# Altium project MC3_r2.PrjPcb (part 6 of 10)

## Sheet DigitalInputs.SchDoc
size Letter; Organization: Altium Limited; Address1: L3, 12a Rodborough Rd; Address2: Frenchs Forest; Address3: NSW; Address4: Australia 2086; DocumentNumber: D_15; SheetNumber: 15; SheetTotal: 21
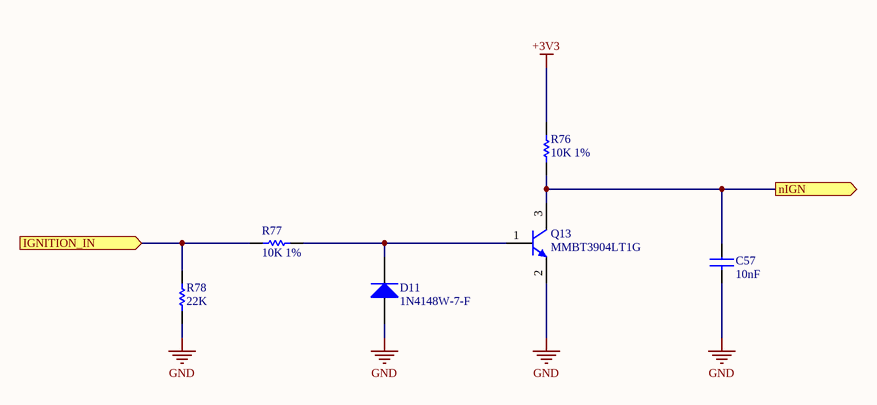
[diagram p9: DigitalInputs.SchDoc]

### Parts
C57  10nF  [C0805]
D11  1N4148W-7-F  [DIOD-SOD123-2_V]
Q13  MMBT3904LT1G  [ONSC-SOT-23-3-318-08_V]
R76  10K 1%  [R0805]
R77  10K 1%  [R0805]
R78  22K  [R0805]

### Ports
IGNITION_IN (in), nIGN (out)

### Nets
+3V3: R76.2
GND: C57.2 D11.1(A) Q13.2(E) R78.1
IGNITION: R77.1 R78.2 ; port IGNITION_IN
nIGNITION: C57.1 Q13.3(C) R76.1 ; port nIGN
NetD11_2: D11.2(K) Q13.1(B) R77.2

### Notes on the sheet
- Title
- Size:
- Date:
- Letter
- Number:
- Time:
- Revision:
- Sheet
- of
- Fluid Power Training
- Institute Inc.
- 2170 S 3040 W
- Salt Lake City, 84119,UT.
- United States.
- File:

### Library data of the parts
C57 = CC0805KRX7R9BB103: YAGEO - CC0805KRX7R9BB103 - SMD Multilayer Ceramic Capacitor, 10000 pF, 50 V, 0805 [2012 Metric], ± 10%, X7R, CC Series; Voltage Rating: 50V; Insulation Resistance: 100GR; Supplier 1: Mouser; Supplier Part Number 1: 603-CC805KRX7R9BB103; Manufacturer: Yageo; Manufacturer Part Number: CC0805KRX7R9BB103; RoHS: Yes; Category: Ceramic Capacitors; Stock 1: 473100; Pricing 1: 1=0.11000, 10=0.05700, 100=0.02600, 1000=0.02100, 4000=0.01600, 8000=0.01400 (USD); Mount: Surface Mount; Case/Package: 0805; Number of Pins: 2; Case Code (Imperial): 0805; Case Code (Metric): 2012; Material: Ceramic; Min Operating Temperature: -55°C; Max Operating Temperature: 125°C; Packaging: Tape and Reel; Capacitance: 10nF; Tolerance: 10%; Package Quantity: 1; Dielectric: X7R; Termination: SMD/SMT; Voltage Rating (DC): 50V; Voltage: 50V; Composition: Ceramic; Length: 2mm; Height: 0.6mm; Width: 1.25mm; Depth: 1.25mm; Thickness: 0.024inch; Radiation Hardening: No; REACH SVHC: No SVHC; Lead Free: Lead Free; Halogen Free: Halogen Free; ComponentLink1URL: https://datasheet.ciiva.com/11786/0900766b80d84f1d-11786119.pdf?src-supplier=RSComponents; ComponentLink1Description: https://datasheet.ciiva.com/11786/0900766b80d84f1d-11786119.pdf?src-supplier=RSComponents; ComponentLink2URL: https://datasheet.ciiva.com/25613/0900766b8027bcf6-25613113.pdf?src-supplier=RSComponents; ComponentLink2Description: https://datasheet.ciiva.com/25613/0900766b8027bcf6-25613113.pdf?src-supplier=RSComponents; ComponentLink3URL: https://datasheet.ciiva.com/144/mlccorderingcode-144533.pdf?src-supplier=Digi-Key; ComponentLink3Description: https://datasheet.ciiva.com/144/mlccorderingcode-144533.pdf?src-supplier=Digi-Key; ComponentLink4URL: https://datasheet.ciiva.com/144/mlccorderingcode-144534.pdf?src-supplier=Digi-Key; ComponentLink4Description: https://datasheet.ciiva.com/144/mlccorderingcode-144534.pdf?src-supplier=Digi-Key; ComponentLink5URL: https://datasheet.ciiva.com/46372/1784427-46372638.pdf?src-supplier=Element14; ComponentLink5Description: https://datasheet.ciiva.com/46372/1784427-46372638.pdf?src-supplier=Element14; ComponentLink6URL: https://datasheet.ciiva.com/144/mlccorderingcode-144532.pdf?src-supplier=Digi-Key; ComponentLink6Description: https://datasheet.ciiva.com/144/mlccorderingcode-144532.pdf?src-supplier=Digi-Key; ComponentLink7URL: https://datasheet.ciiva.com/16625/upy-gphc-x7r-6-3v-to-50v-8-16625548.pdf?src-supplier=Avnet+Europe; ComponentLink7Description: https://datasheet.ciiva.com/16625/upy-gphc-x7r-6-3v-to-50v-8-16625548.pdf?src-supplier=Avnet+Europe; ComponentLink8URL: https://datasheet.ciiva.com/22749/1489800-22749215.pdf?src-supplier=Element14; ComponentLink8Description: https://datasheet.ciiva.com/22749/1489800-22749215.pdf?src-supplier=Element14; ComponentLink9URL: https://datasheet.ciiva.com/46372/1734573-46372639.pdf?src-supplier=Element14; ComponentLink9Description: https://datasheet.ciiva.com/46372/1734573-46372639.pdf?src-supplier=Element14
D11 = 1N4148W-7-F: DIODE GEN PURP 100V 300MA SOD123; Manufacturer: Diodes; Reverse Recovery Time: 4ns; Forward Voltage: 1.25V; Element Configuration: Single; Forward Current: 150mA; Peak Non-Repetitive Surge Current: 2A; Power Dissipation: 400mW; Peak Reverse Current: 1uA; Polarity: Standard; Voltage Rating (DC): 75V; Capacitance: 2pF; Current: 15A; Supplier 1: Mouser; Supplier Part Number 1: 621-1N4148W-F; Manufacturer Part Number: 1N4148W-7-F; RoHS: Yes; Category: Rectifier Diodes; Stock 1: 1274151; Pricing 1: 1=0.16000, 10=0.15000, 100=0.05300, 1000=0.03500, 3000=0.02700, 9000=0.02400 (USD); Mount: Surface Mount; Number of Pins: 2; Weight: 0.000353oz; Contact Plating: Tin,Matte; Min Operating Temperature: -65°C; Max Operating Temperature: 150°C; Packaging: Tape and Reel; Max Repetitive Reverse Voltage (Vrrm): 100V; Package Quantity: 3000; Average Rectified Current: 300mA; Max Reverse Voltage (DC): 100V; Recovery Time: 4ns; Max Forward Surge Current (Ifsm): 2A; Max Surge Current: 2A; Current Rating: 150mA; Output Current: 150mA; Voltage: 100V; Power Rating: 400mW; Length: 2.85mm; Height: 1.25mm; Width: 1.7mm; Radiation Hardening: No; Lead Free: Lead Free; REACH SVHC: No SVHC; ComponentLink1URL: https://datasheet.ciiva.com/4435/ds30086-4435128.pdf?src-supplier=Mouser; ComponentLink1Description: https://datasheet.ciiva.com/4435/ds30086-4435128.pdf?src-supplier=Mouser; ComponentLink2URL: https://datasheet.ciiva.com/8300/ds30086-8300392.pdf?src-supplier=Avnet; ComponentLink2Description: https://datasheet.ciiva.com/8300/ds30086-8300392.pdf?src-supplier=Avnet; ComponentLink3URL: https://datasheet.ciiva.com/911/ds30086-911734.pdf?src-supplier=Digi-Key; ComponentLink3Description: https://datasheet.ciiva.com/911/ds30086-911734.pdf?src-supplier=Digi-Key; ComponentLink4URL: https://datasheet.ciiva.com/911/ds30086-911735.pdf?src-supplier=Digi-Key; ComponentLink4Description: https://datasheet.ciiva.com/911/ds30086-911735.pdf?src-supplier=Digi-Key; ComponentLink5URL: https://datasheet.ciiva.com/22695/1915529-22695239.pdf?src-supplier=Element14; ComponentLink5Description: https://datasheet.ciiva.com/22695/1915529-22695239.pdf?src-supplier=Element14; ComponentLink6URL: https://datasheet.ciiva.com/911/ds30086-911736.pdf?src-supplier=Digi-Key; ComponentLink6Description: https://datasheet.ciiva.com/911/ds30086-911736.pdf?src-supplier=Digi-Key; ComponentLink7URL: https://datasheet.ciiva.com/1179/1915529-1179304.pdf?src-supplier=Element14; ComponentLink7Description: https://datasheet.ciiva.com/1179/1915529-1179304.pdf?src-supplier=Element14; ComponentLink8URL: https://datasheet.ciiva.com/25919/ds30086-25919609.pdf?src-supplier=Avnet+Europe; ComponentLink8Description: https://datasheet.ciiva.com/25919/ds30086-25919609.pdf?src-supplier=Avnet+Europe; ComponentLink9URL: https://datasheet.ciiva.com/15219/getdatasheetpartid-110030-15219548.pdf?src-supplier=Verical; ComponentLink9Description: https://datasheet.ciiva.com/15219/getdatasheetpartid-110030-15219548.pdf?src-supplier=Verical; ComponentLink10URL: https://datasheet.ciiva.com/8303/ds30086-8303197.pdf?src-supplier=Avnet; ComponentLink10Description: https://datasheet.ciiva.com/8303/ds30086-8303197.pdf?src-supplier=Avnet
Q13 = MMBT3904LT1G: ON Semi MMBT3904LT1G NPN Bipolar Transistor, 0.2 A, 40 V, 3-Pin SOT-23; Manufacturer: ON Semiconductor; Collector Emitter Breakdown Voltage: 40V; Max Power Dissipation: 300mW; Max Collector Current: 200mA; Collector Base Voltage (VCBO): 60V; Emitter Base Voltage (VEBO): 6V; Element Configuration: Single; Transition Frequency: 300MHz; Collector Emitter Saturation Voltage: 300mV; hFE Min: 100; Number of Elements: 1; Type: General Purpose; Supplier 1: Mouser; Supplier Part Number 1: 863-MMBT3904LT1G; Manufacturer Part Number: MMBT3904LT1G; RoHS: Yes; Category: BJTs; Stock 1: 753014; Pricing 1: 1=0.12000, 10=0.10900, 100=0.03800, 1000=0.02500, 3000=0.01900, 9000=0.01700 (USD); Case/Package: SOT-23-3; Number of Pins: 3; Contact Plating: Tin,Matte; Min Operating Temperature: -55°C; Max Operating Temperature: 150°C; Packaging: Tape and Reel; Polarity: NPN; Collector Emitter Voltage (VCEO): 40V; Package Quantity: 1; Gain Bandwidth Product: 300MHz; Power Dissipation: 300mW; Max Breakdown Voltage: 40V; Voltage Rating (DC): 40V; Current Rating: 200mA; Frequency: 300MHz; Max Frequency: 300MHz; Length: 2.9mm; Height: 0.94mm; Width: 1.3mm; Radiation Hardening: No; Lead Free: Lead Free; REACH SVHC: No SVHC; ComponentLink1URL: https://datasheet.ciiva.com/16199/mmbt3904lt1-d-16199009.pdf?src-supplier=Future+Electronics; ComponentLink1Description: https://datasheet.ciiva.com/16199/mmbt3904lt1-d-16199009.pdf?src-supplier=Future+Electronics; ComponentLink2URL: https://datasheet.ciiva.com/4723/mmbt3904lt1-d-113169-4723050.pdf?src-supplier=Mouser; ComponentLink2Description: https://datasheet.ciiva.com/4723/mmbt3904lt1-d-113169-4723050.pdf?src-supplier=Mouser; ComponentLink3URL: https://datasheet.ciiva.com/15138/getdatasheetpartid-53263-15138779.pdf?src-supplier=Verical; ComponentLink3Description: https://datasheet.ciiva.com/15138/getdatasheetpartid-53263-15138779.pdf?src-supplier=Verical; ComponentLink4URL: https://datasheet.ciiva.com/976/mmbt3904lt1-d-976362.pdf?src-supplier=Digi-Key; ComponentLink4Description: https://datasheet.ciiva.com/976/mmbt3904lt1-d-976362.pdf?src-supplier=Digi-Key; ComponentLink5URL: https://datasheet.ciiva.com/16478/mmbt3904lt1-d-16478538.pdf?src-supplier=Avnet+Asia; ComponentLink5Description: https://datasheet.ciiva.com/16478/mmbt3904lt1-d-16478538.pdf?src-supplier=Avnet+Asia; ComponentLink6URL: https://datasheet.ciiva.com/976/mmbt3904lt1-d-976363.pdf?src-supplier=Digi-Key; ComponentLink6Description: https://datasheet.ciiva.com/976/mmbt3904lt1-d-976363.pdf?src-supplier=Digi-Key; ComponentLink7URL: https://datasheet.ciiva.com/11199/mmbt3904lt1-d-11199003.pdf?src-supplier=Avnet; ComponentLink7Description: https://datasheet.ciiva.com/11199/mmbt3904lt1-d-11199003.pdf?src-supplier=Avnet; ComponentLink8URL: https://datasheet.ciiva.com/976/mmbt3904lt1-d-976364.pdf?src-supplier=Digi-Key; ComponentLink8Description: https://datasheet.ciiva.com/976/mmbt3904lt1-d-976364.pdf?src-supplier=Digi-Key; ComponentLink9URL: https://datasheet.ciiva.com/14546/70099530-14546188.pdf?src-supplier=Allied+Electronics; ComponentLink9Description: https://datasheet.ciiva.com/14546/70099530-14546188.pdf?src-supplier=Allied+Electronics; ComponentLink10URL: https://datasheet.ciiva.com/7972/1708269-7972381.pdf?src-supplier=Element14; ComponentLink10Description: https://datasheet.ciiva.com/7972/1708269-7972381.pdf?src-supplier=Element14; ComponentLink11URL: https://datasheet.ciiva.com/22664/1708269-22664159.pdf?src-supplier=Element14; ComponentLink11Description: https://datasheet.ciiva.com/22664/1708269-22664159.pdf?src-supplier=Element14
R76 R77 = CRCW080510K0FKEA: VISHAY - CRCW080510K0FKEA - SMD Chip Resistor, 0805 [2012 Metric], 10 kohm, CRCW e3 Series, 150 V, Thick Film, 125 mW; Resistance: 10kR; Temperature Coefficient: 100ppm/°C; Power Rating: 125mW; Voltage Rating: 150V; Supplier 1: Mouser; Supplier Part Number 1: 71-CRCW0805-10K-E3; Manufacturer: Vishay; Manufacturer Part Number: CRCW080510K0FKEA; RoHS: Yes; Category: Chip SMD Resistors; Stock 1: 1138857; Pricing 1: 1=0.10000, 10=0.06200, 100=0.02500, 1000=0.01000, 5000=0.00700, 10000=0.00600 (USD); Case/Package: 0805; Weight: 0.000194oz; Case Code (Imperial): 0805; Case Code (Metric): 2012; Contact Plating: Tin; Min Operating Temperature: -55°C; Max Operating Temperature: 155°C; Tolerance: 1%; Packaging: Tape and Reel; Composition: Thick Film; Termination: SMD/SMT; Voltage Rating (DC): 150V; Package Quantity: 5000; Military Standard: Not; Length: 2mm; Height: 0.45mm; Width: 1.25mm; Depth: 1.25mm; Radiation Hardening: No; Lead Free: Lead Free; REACH SVHC: Unknown; ComponentLink1URL: https://datasheet.ciiva.com/11808/0900766b80d98b26-11808216.pdf?src-supplier=RSComponents; ComponentLink1Description: https://datasheet.ciiva.com/11808/0900766b80d98b26-11808216.pdf?src-supplier=RSComponents; ComponentLink2URL: https://datasheet.ciiva.com/5547/dcrcwe3-109170-5547559.pdf?src-supplier=Mouser; ComponentLink2Description: https://datasheet.ciiva.com/5547/dcrcwe3-109170-5547559.pdf?src-supplier=Mouser; ComponentLink3URL: https://datasheet.ciiva.com/16719/70201119-16719082.pdf?src-supplier=Allied+Electronics; ComponentLink3Description: https://datasheet.ciiva.com/16719/70201119-16719082.pdf?src-supplier=Allied+Electronics; ComponentLink4URL: https://datasheet.ciiva.com/16883/dcrcwe3-16883708.pdf?src-supplier=Avnet+Europe; ComponentLink4Description: https://datasheet.ciiva.com/16883/dcrcwe3-16883708.pdf?src-supplier=Avnet+Europe; ComponentLink5URL: https://datasheet.ciiva.com/8337/dcrcwe3-8337773.pdf?src-supplier=Avnet; ComponentLink5Description: https://datasheet.ciiva.com/8337/dcrcwe3-8337773.pdf?src-supplier=Avnet; ComponentLink6URL: https://datasheet.ciiva.com/46394/1720486-46394381.pdf?src-supplier=Element14; ComponentLink6Description: https://datasheet.ciiva.com/46394/1720486-46394381.pdf?src-supplier=Element14; ComponentLink7URL: https://datasheet.ciiva.com/16199/dcrcwe3-16199086.pdf?src-supplier=Future+Electronics; ComponentLink7Description: https://datasheet.ciiva.com/16199/dcrcwe3-16199086.pdf?src-supplier=Future+Electronics; ComponentLink8URL: https://datasheet.ciiva.com/16514/dcrcwe3-16514907.pdf?src-supplier=Avnet+Asia; ComponentLink8Description: https://datasheet.ciiva.com/16514/dcrcwe3-16514907.pdf?src-supplier=Avnet+Asia; ComponentLink9URL: https://datasheet.ciiva.com/16755/70201119-16755389.pdf?src-supplier=Allied+Electronics; ComponentLink9Description: https://datasheet.ciiva.com/16755/70201119-16755389.pdf?src-supplier=Allied+Electronics; ComponentLink10URL: https://datasheet.ciiva.com/8337/dcrcwe3-8337774.pdf?src-supplier=Avnet; ComponentLink10Description: https://datasheet.ciiva.com/8337/dcrcwe3-8337774.pdf?src-supplier=Avnet
R78 = ERJ6ENF2202V: as R41 on sheet RPM Inputs; Supplier 1: Mouser; Supplier Part Number 1: 667-ERJ-6ENF2202V; Manufacturer: Panasonic; Manufacturer Part Number: ERJ6ENF2202V; RoHS: Yes; Category: Chip SMD Resistors; Stock 1: 57430; Pricing 1: 1=0.10000, 10=0.08300, 100=0.03200, 1000=0.01800, 5000=0.01800, 10000=0.01800 (USD); Mount: Surface Mount; Case/Package: 0805; Number of Pins: 2; Case Code (Imperial): 0805; Case Code (Metric): 2012; Contact Plating: Tin; Min Operating Temperature: -55°C; Max Operating Temperature: 155°C; Packaging: Tape and Reel; Composition: Thick Film; Number of Terminations: 2; Max Power Dissipation: 125mW; Termination: SMD/SMT; Package Quantity: 1; Voltage Rating (DC): 150V; Features: Automotive AEC-Q200; Military Standard: Not; Length: 2mm; Height: 0.6mm; Width: 1.2mm; Depth: 1.25mm; Radiation Hardening: No; Lead Free: Lead Free; REACH SVHC: No SVHC; ComponentLink1URL: https://datasheet.ciiva.com/11821/0900766b80f80784-11821559.pdf?src-supplier=RSComponents; ComponentLink1Description: https://datasheet.ciiva.com/11821/0900766b80f80784-11821559.pdf?src-supplier=RSComponents; ComponentLink2URL: https://datasheet.ciiva.com/24070/aoa0000ce2-24070245.pdf?src-supplier=Mouser; ComponentLink2Description: https://datasheet.ciiva.com/24070/aoa0000ce2-24070245.pdf?src-supplier=Mouser; ComponentLink3URL: https://datasheet.ciiva.com/30139/aoa0000ce2-30139797.pdf?src-supplier=Onlinecomponents.com; ComponentLink3Description: https://datasheet.ciiva.com/30139/aoa0000ce2-30139797.pdf?src-supplier=Onlinecomponents.com; ComponentLink4URL: https://datasheet.ciiva.com/7802/426256-7802439.pdf?src-supplier=Element14; ComponentLink4Description: https://datasheet.ciiva.com/7802/426256-7802439.pdf?src-supplier=Element14; ComponentLink5URL: https://datasheet.ciiva.com/22687/1678782-22687079.pdf?src-supplier=Element14; ComponentLink5Description: https://datasheet.ciiva.com/22687/1678782-22687079.pdf?src-supplier=Element14; ComponentLink6URL: https://datasheet.ciiva.com/16787/70260748-16787961.pdf?src-supplier=Allied+Electronics; ComponentLink6Description: https://datasheet.ciiva.com/16787/70260748-16787961.pdf?src-supplier=Allied+Electronics; ComponentLink7URL: https://datasheet.ciiva.com/17210/aoa0000ce2-17210956.pdf?src-supplier=Avnet+Europe; ComponentLink7Description: https://datasheet.ciiva.com/17210/aoa0000ce2-17210956.pdf?src-supplier=Avnet+Europe; ComponentLink8URL: https://datasheet.ciiva.com/22668/1678782-22668332.pdf?src-supplier=Element14; ComponentLink8Description: https://datasheet.ciiva.com/22668/1678782-22668332.pdf?src-supplier=Element14; ComponentLink9URL: https://datasheet.ciiva.com/6138/426256-6138190.pdf?src-supplier=Farnell; ComponentLink9Description: https://datasheet.ciiva.com/6138/426256-6138190.pdf?src-supplier=Farnell; ComponentLink10URL: https://datasheet.ciiva.com/46419/1678782-46419998.pdf?src-supplier=Element14; ComponentLink10Description: https://datasheet.ciiva.com/46419/1678782-46419998.pdf?src-supplier=Element14

## Sheet MC_Connector.SchDoc
size Letter; DocumentNumber: D_16; SheetNumber: 16; SheetTotal: 21
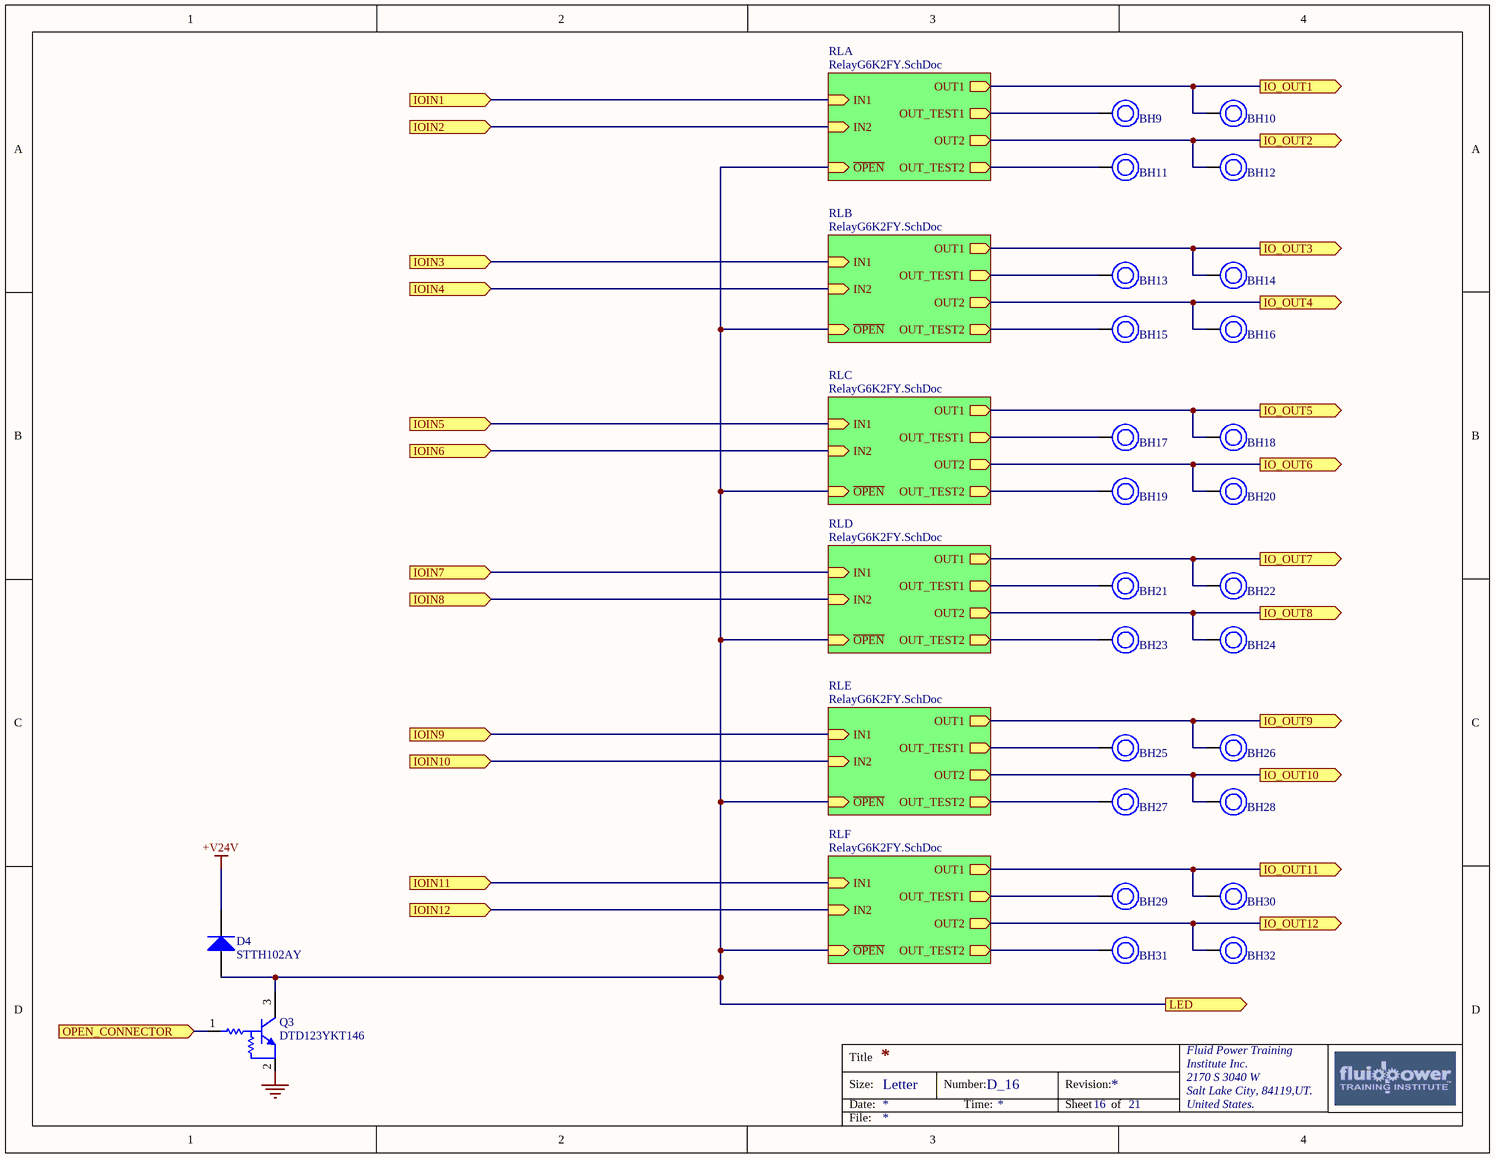
[diagram p10: MC_Connector.SchDoc]

### Parts
BH9  BananaHole  [BananaHole]  (value not drawn)  (no BOM)
BH10  BananaHole  [BananaHole]  (value not drawn)  (no BOM)
BH11  BananaHole  [BananaHole]  (value not drawn)  (no BOM)
BH12  BananaHole  [BananaHole]  (value not drawn)  (no BOM)
BH13  BananaHole  [BananaHole]  (value not drawn)  (no BOM)
BH14  BananaHole  [BananaHole]  (value not drawn)  (no BOM)
BH15  BananaHole  [BananaHole]  (value not drawn)  (no BOM)
BH16  BananaHole  [BananaHole]  (value not drawn)  (no BOM)
BH17  BananaHole  [BananaHole]  (value not drawn)  (no BOM)
BH18  BananaHole  [BananaHole]  (value not drawn)  (no BOM)
BH19  BananaHole  [BananaHole]  (value not drawn)  (no BOM)
BH20  BananaHole  [BananaHole]  (value not drawn)  (no BOM)
BH21  BananaHole  [BananaHole]  (value not drawn)  (no BOM)
BH22  BananaHole  [BananaHole]  (value not drawn)  (no BOM)
BH23  BananaHole  [BananaHole]  (value not drawn)  (no BOM)
BH24  BananaHole  [BananaHole]  (value not drawn)  (no BOM)
BH25  BananaHole  [BananaHole]  (value not drawn)  (no BOM)
BH26  BananaHole  [BananaHole]  (value not drawn)  (no BOM)
BH27  BananaHole  [BananaHole]  (value not drawn)  (no BOM)
BH28  BananaHole  [BananaHole]  (value not drawn)  (no BOM)
BH29  BananaHole  [BananaHole]  (value not drawn)  (no BOM)
BH30  BananaHole  [BananaHole]  (value not drawn)  (no BOM)
BH31  BananaHole  [BananaHole]  (value not drawn)  (no BOM)
BH32  BananaHole  [BananaHole]  (value not drawn)  (no BOM)
D4  STTH102AY  [DIOM4326X26M]
Q3  DTD123YKT146  [SOT95P280X130-3N]

### Sub-sheets
RLA = RelayG6K2FY.SchDoc: IN2 (in), IN1 (in), OUT2 (out), OUT1 (out), OUT_TEST1 (out), OUT_TEST2 (out), ~{OPEN} (in)
RLB = RelayG6K2FY.SchDoc: IN2 (in), IN1 (in), OUT2 (out), OUT1 (out), OUT_TEST1 (out), OUT_TEST2 (out), ~{OPEN} (in)
RLC = RelayG6K2FY.SchDoc: IN2 (in), IN1 (in), OUT2 (out), OUT1 (out), OUT_TEST1 (out), OUT_TEST2 (out), ~{OPEN} (in)
RLD = RelayG6K2FY.SchDoc: IN2 (in), IN1 (in), OUT2 (out), OUT1 (out), OUT_TEST1 (out), OUT_TEST2 (out), ~{OPEN} (in)
RLE = RelayG6K2FY.SchDoc: IN2 (in), IN1 (in), OUT2 (out), OUT1 (out), OUT_TEST1 (out), OUT_TEST2 (out), ~{OPEN} (in)
RLF = RelayG6K2FY.SchDoc: IN2 (in), IN1 (in), OUT2 (out), OUT1 (out), OUT_TEST1 (out), OUT_TEST2 (out), ~{OPEN} (in)

### Ports
IO_OUT1 (out), IO_OUT2 (out), IO_OUT3 (out), IO_OUT4 (out), IO_OUT5 (out), IO_OUT6 (out), IO_OUT7 (out), IO_OUT8 (out), IO_OUT9 (out), IO_OUT10 (out), IO_OUT11 (out), IO_OUT12 (out), IOIN1 (in), IOIN2 (in), IOIN3 (in), IOIN4 (in), IOIN5 (in), IOIN6 (in), IOIN7 (in), IOIN8 (in), IOIN9 (in), IOIN10 (in), IOIN11 (in), IOIN12 (in), LED (out), OPEN_CONNECTOR (in)

### Nets
+V24V: D4.1(K)
GND: Q3.2(E)
COOL_RET: BH16.1 ; port IO_OUT4, sheet RLB/OUT2
COOL_RET: port IOIN4, sheet RLB/IN2  [a separate net that carries the same name]
COOL_TEMP_IN: port IOIN5, sheet RLC/IN1
COOL_TEMP_INa: BH18.1 ; port IO_OUT5, sheet RLC/OUT1
LED_CONNECTOR: D4.2(A) Q3.3(C) ; port LED, sheet RLA/~{OPEN}, sheet RLB/~{OPEN}, sheet RLC/~{OPEN}, sheet RLD/~{OPEN}, sheet RLE/~{OPEN}, sheet RLF/~{OPEN}
OIL_PRESS_IN: BH22.1 ; port IO_OUT7, sheet RLD/OUT1
OIL_PRESS_IN: port IOIN7, sheet RLD/IN1  [a separate net that carries the same name]
OIL_RET: BH20.1 ; port IO_OUT6, sheet RLC/OUT2
OIL_RET: port IOIN6, sheet RLC/IN2  [a separate net that carries the same name]
Open_Connector: Q3.1(B) ; port OPEN_CONNECTOR
SPEED1_IN: port IOIN9, sheet RLE/IN1
SPEED1_INa: BH26.1 ; port IO_OUT9, sheet RLE/OUT1
SPEED1_RET: BH24.1 ; port IO_OUT8, sheet RLD/OUT2
SPEED1_RET: port IOIN8, sheet RLD/IN2  [a separate net that carries the same name]
SPEED2_IN: BH30.1 ; port IO_OUT11, sheet RLF/OUT1
SPEED2_IN: port IOIN11, sheet RLF/IN1  [a separate net that carries the same name]
SPEED2_RET: BH28.1 ; port IO_OUT10, sheet RLE/OUT2
SPEED2_RET: port IOIN10, sheet RLE/IN2  [a separate net that carries the same name]
SPEED2_VBAT: BH32.1 ; port IO_OUT12, sheet RLF/OUT2
SPEED2_VBAT: port IOIN12, sheet RLF/IN2  [a separate net that carries the same name]
TPS_5VREF: BH14.1 ; port IO_OUT3, sheet RLB/OUT1
TPS_5VREF: port IOIN3, sheet RLB/IN1  [a separate net that carries the same name]
TPS_RET: BH10.1 ; port IO_OUT1, sheet RLA/OUT1
TPS_RET: port IOIN1, sheet RLA/IN1  [a separate net that carries the same name]
TPS_WIPER: port IOIN2, sheet RLA/IN2
TPS_WIPERa: BH12.1 ; port IO_OUT2, sheet RLA/OUT2
NetBH9_1: BH9.1 ; sheet RLA/OUT_TEST1
NetBH11_1: BH11.1 ; sheet RLA/OUT_TEST2
NetBH13_1: BH13.1 ; sheet RLB/OUT_TEST1
NetBH15_1: BH15.1 ; sheet RLB/OUT_TEST2
NetBH17_1: BH17.1 ; sheet RLC/OUT_TEST1
NetBH19_1: BH19.1 ; sheet RLC/OUT_TEST2
NetBH21_1: BH21.1 ; sheet RLD/OUT_TEST1
NetBH23_1: BH23.1 ; sheet RLD/OUT_TEST2
NetBH25_1: BH25.1 ; sheet RLE/OUT_TEST1
NetBH27_1: BH27.1 ; sheet RLE/OUT_TEST2
NetBH29_1: BH29.1 ; sheet RLF/OUT_TEST1
NetBH31_1: BH31.1 ; sheet RLF/OUT_TEST2

### Notes on the sheet
- Title
- Size:
- Date:
- Letter
- Number:
- Time:
- Revision:
- Sheet
- of
- Fluid Power Training
- Institute Inc.
- 2170 S 3040 W
- Salt Lake City, 84119,UT.
- United States.
- File:

### Library data of the parts
BH9-BH32 = BananaHole: Banana hole for panel testing and board mounting
D4 = STTH102AY: DIODE GEN PURP 200V 1A SMA; Manufacturer: STMicroelectronics; Reverse Recovery Time: 20ns; Forward Voltage: 970mV; Element Configuration: Single; Peak Non-Repetitive Surge Current: 40A; Peak Reverse Current: 1uA; Max Reverse Leakage Current: 25uA; Supplier 1: Mouser; Supplier Part Number 1: 511-STTH102AY; Manufacturer Part Number: STTH102AY; RoHS: Yes; Category: Rectifier Diodes; Stock 1: 13440; Pricing 1: 1=0.51000, 10=0.38600, 100=0.20900, 1000=0.15700, 5000=0.13500, 10000=0.12700 (USD); Mount: Surface Mount; Number of Pins: 2; Min Operating Temperature: -40°C; Max Operating Temperature: 175°C; Packaging: Tape and Reel; Max Repetitive Reverse Voltage (Vrrm): 200V; Forward Current: 1A; Package Quantity: 5000; Average Rectified Current: 1A; Max Reverse Voltage (DC): 200V; Recovery Time: 20ns; Radiation Hardening: No; Lead Free: Lead Free; ComponentLink1URL: https://datasheet.ciiva.com/12327/cd00285726-211663-12327361.pdf?src-supplier=Mouser; ComponentLink1Description: https://datasheet.ciiva.com/12327/cd00285726-211663-12327361.pdf?src-supplier=Mouser; ComponentLink2URL: https://datasheet.ciiva.com/25949/cd00285726-25949278.pdf?src-supplier=Avnet+Europe; ComponentLink2Description: https://datasheet.ciiva.com/25949/cd00285726-25949278.pdf?src-supplier=Avnet+Europe; ComponentLink3URL: https://datasheet.ciiva.com/915/cd00285726-915840.pdf?src-supplier=Digi-Key; ComponentLink3Description: https://datasheet.ciiva.com/915/cd00285726-915840.pdf?src-supplier=Digi-Key; ComponentLink4URL: https://datasheet.ciiva.com/915/cd00285726-915841.pdf?src-supplier=Digi-Key; ComponentLink4Description: https://datasheet.ciiva.com/915/cd00285726-915841.pdf?src-supplier=Digi-Key; ComponentLink5URL: https://datasheet.ciiva.com/915/cd00285726-915842.pdf?src-supplier=Digi-Key; ComponentLink5Description: https://datasheet.ciiva.com/915/cd00285726-915842.pdf?src-supplier=Digi-Key; Case/Package: SMA
Q3 = DTD123YKT146: TRANS PREBIAS NPN 200MW SMT3; Manufacturer: Rohm; Collector Emitter Voltage (VCEO): 300mV; Element Configuration: Single; hFE Min: 56; Max Collector Current: 500mA; Collector Emitter Breakdown Voltage: 50V; Transition Frequency: 200MHz; Supplier 1: Mouser; Supplier Part Number 1: 755-DTD123YKT146; Manufacturer Part Number: DTD123YKT146; RoHS: Yes; Category: BJTs; Stock 1: 8666; Pricing 1: 1=0.38000, 10=0.28800, 100=0.15600, 1000=0.11700, 3000=0.10100, 9000=0.09500 (USD); Mount: Surface Mount; Case/Package: SMD/SMT; Number of Pins: 3; Min Operating Temperature: -55°C; Max Operating Temperature: 150°C; Packaging: Tape and Reel; Package Quantity: 1; Max Power Dissipation: 200mW; Polarity: NPN; Power Dissipation: 200mW; Max Breakdown Voltage: 50V; Voltage Rating (DC): 50V; Current Rating: 500mA; Termination: SMD/SMT; Max Output Current: 500mA; Operating Supply Voltage: 50V; Continuous Collector Current: 500mA; Length: 2.9mm; Height: 1.1mm; Width: 1.6mm; Radiation Hardening: No; REACH SVHC: No SVHC; Lead Free: Lead Free; ComponentLink1URL: https://datasheet.ciiva.com/6356/dtd123yk-6356016.pdf?src-supplier=Digi-Key; ComponentLink1Description: https://datasheet.ciiva.com/6356/dtd123yk-6356016.pdf?src-supplier=Digi-Key; ComponentLink2URL: https://datasheet.ciiva.com/16616/dtd123yk-16616256.pdf?src-supplier=Avnet+Europe; ComponentLink2Description: https://datasheet.ciiva.com/16616/dtd123yk-16616256.pdf?src-supplier=Avnet+Europe; ComponentLink3URL: https://datasheet.ciiva.com/5782/1645233-5782035.pdf?src-supplier=Farnell; ComponentLink3Description: https://datasheet.ciiva.com/5782/1645233-5782035.pdf?src-supplier=Farnell; ComponentLink4URL: https://datasheet.ciiva.com/16953/0900766b8101ddb2-16953270.pdf?src-supplier=Allied+Electronics; ComponentLink4Description: https://datasheet.ciiva.com/16953/0900766b8101ddb2-16953270.pdf?src-supplier=Allied+Electronics; ComponentLink5URL: https://datasheet.ciiva.com/12316/dtd123yk-210516-12316106.pdf?src-supplier=Mouser; ComponentLink5Description: https://datasheet.ciiva.com/12316/dtd123yk-210516-12316106.pdf?src-supplier=Mouser; ComponentLink6URL: https://datasheet.ciiva.com/8029/1645233-8029419.pdf?src-supplier=Element14; ComponentLink6Description: https://datasheet.ciiva.com/8029/1645233-8029419.pdf?src-supplier=Element14; ComponentLink7URL: https://datasheet.ciiva.com/11210/dtd123yk-11210380.pdf?src-supplier=Avnet; ComponentLink7Description: https://datasheet.ciiva.com/11210/dtd123yk-11210380.pdf?src-supplier=Avnet

## Sheet RelayG6K2FY.SchDoc
size Letter; Organization: Altium Limited; Address1: L3, 12a Rodborough Rd; Address2: Frenchs Forest; Address3: NSW; Address4: Australia 2086; DocumentNumber: D_20; SheetNumber: 20; SheetTotal: 21
Used 6 times, as channels U_MC3_blocks/U_MC3_module/U_MC_Connector/RLA, U_MC3_blocks/U_MC3_module/U_MC_Connector/RLB, U_MC3_blocks/U_MC3_module/U_MC_Connector/RLC, U_MC3_blocks/U_MC3_module/U_MC_Connector/RLD, U_MC3_blocks/U_MC3_module/U_MC_Connector/RLE, U_MC3_blocks/U_MC3_module/U_MC_Connector/RLF. Parts and nets are listed once, with the designators drawn on the sheet.
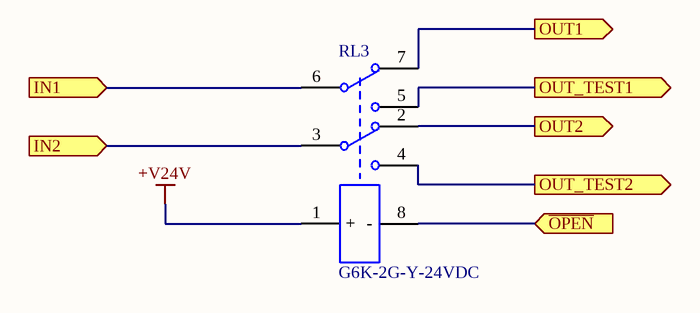
[diagram p11: RelayG6K2FY.SchDoc]

### Parts
RL3  G6K-2G-Y-24VDC  [G6K-2F-Y]

### Ports
IN1 (in), IN2 (in), OUT1 (out), OUT2 (out), OUT_TEST1 (out), OUT_TEST2 (out), ~{OPEN} (in)

### Nets
+V24V: RL3.1(+)
IN1: RL3.6 ; port IN1
IN2: RL3.3 ; port IN2
~{OPEN}: RL3.8(-) ; port ~{OPEN}
OUT1: RL3.7 ; port OUT1
OUT2: RL3.2 ; port OUT2
OUT_TEST1: RL3.5 ; port OUT_TEST1
OUT_TEST2: RL3.4 ; port OUT_TEST2

### Channels
U_MC3_blocks/U_MC3_module/U_MC_Connector/RLA: designators end in _RLA; ports IN1=TPS_RET IN2=TPS_WIPER OUT1=TPS_RET OUT2=TPS_WIPERa OUT_TEST1=NetBH9_1 OUT_TEST2=NetBH11_1 ~{OPEN}=LED_CONNECTOR
U_MC3_blocks/U_MC3_module/U_MC_Connector/RLB: designators end in _RLB; ports IN1=TPS_5VREF IN2=COOL_RET OUT1=TPS_5VREF OUT2=COOL_RET OUT_TEST1=NetBH13_1 OUT_TEST2=NetBH15_1 ~{OPEN}=LED_CONNECTOR
U_MC3_blocks/U_MC3_module/U_MC_Connector/RLC: designators end in _RLC; ports IN1=COOL_TEMP_IN IN2=OIL_RET OUT1=COOL_TEMP_INa OUT2=OIL_RET OUT_TEST1=NetBH17_1 OUT_TEST2=NetBH19_1 ~{OPEN}=LED_CONNECTOR
U_MC3_blocks/U_MC3_module/U_MC_Connector/RLD: designators end in _RLD; ports IN1=OIL_PRESS_IN IN2=SPEED1_RET OUT1=OIL_PRESS_IN OUT2=SPEED1_RET OUT_TEST1=NetBH21_1 OUT_TEST2=NetBH23_1 ~{OPEN}=LED_CONNECTOR
U_MC3_blocks/U_MC3_module/U_MC_Connector/RLE: designators end in _RLE; ports IN1=SPEED1_IN IN2=SPEED2_RET OUT1=SPEED1_INa OUT2=SPEED2_RET OUT_TEST1=NetBH25_1 OUT_TEST2=NetBH27_1 ~{OPEN}=LED_CONNECTOR
U_MC3_blocks/U_MC3_module/U_MC_Connector/RLF: designators end in _RLF; ports IN1=SPEED2_IN IN2=SPEED2_VBAT OUT1=SPEED2_IN OUT2=SPEED2_VBAT OUT_TEST1=NetBH29_1 OUT_TEST2=NetBH31_1 ~{OPEN}=LED_CONNECTOR

### Notes on the sheet
- Title
- Size:
- Date:
- Letter
- Number:
- Time:
- Revision:
- Sheet
- of
- Fluid Power Training
- Institute Inc.
- 2170 S 3040 W
- Salt Lake City, 84119,UT.
- United States.
- File:

### Library data of the parts
RL3 = G6K-2G-Y-24VDC: Electromechanical Relay DPDT 1A 24VDC 5.22KOhm Surface Mount; Manufacturer: Omron; Manufacturer Part Number: G6K-2F-YDC24; Coil Current: 4.6mA; Coil Resistance: 5.22kR; Coil Voltage (DC): 24V; Max Voltage Rating (AC): 125V; Max Voltage Rating (DC): 60V; Operate Time: 3ms; Coil Type: Non-Latching; Relay Type: Telecom; Coil Power: 100mW; Supplier 1: Mouser; Supplier Part Number 1: 653-G6K-2F-Y-DC24; RoHS: Yes; Category: Signal Relays; Mount: Surface Mount; Number of Pins: 8; Weight: 0.024692oz; Contact Material: Gold,Silver; Min Operating Temperature: -40°C; Max Operating Temperature: 70°C; Packaging: Rail/Tube; Throw Configuration: DPDT; Max Current Rating: 1A; Contact Current Rating: 1A; Termination: Gull Wing; Package Quantity: 50; Release Time: 3ms; Power Consumption: 100mW; Voltage Rating (AC): 125V; Voltage Rating (DC): 60V; Length: 10mm; Depth: 7.8mm; Radiation Hardening: No; Lead Free: Lead Free; ComponentLink1URL: https://datasheet.ciiva.com/30066/81en-g6k-30066045.pdf?src-supplier=Onlinecomponents.com; ComponentLink1Description: https://datasheet.ciiva.com/30066/81en-g6k-30066045.pdf?src-supplier=Onlinecomponents.com

## Sheet DCMotorControl.SchDoc
size Letter; Organization: Altium Limited; Address1: L3, 12a Rodborough Rd; Address2: Frenchs Forest; Address3: NSW; Address4: Australia 2086; DocumentNumber: D_14; SheetNumber: 14; SheetTotal: 21
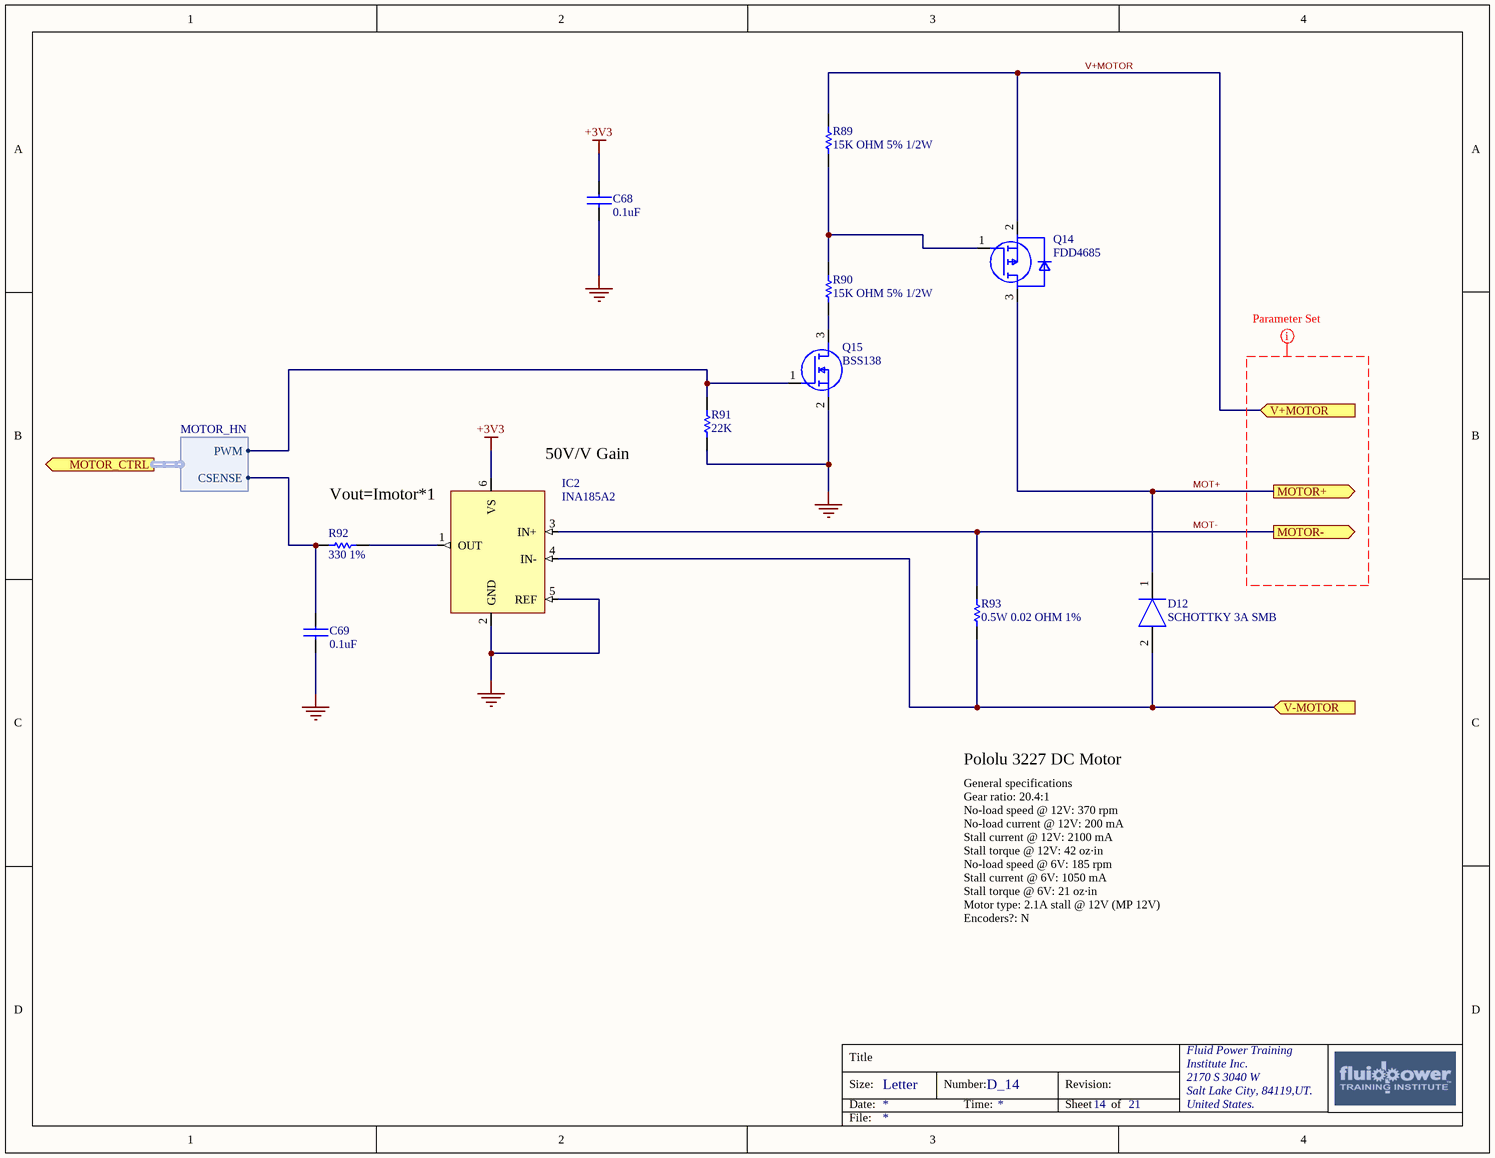
[diagram p12: DCMotorControl.SchDoc]

### Parts
C68  0.1uF  [C0805]
C69  0.1uF  [C0805]
D12  SCHOTTKY 3A SMB  [DIOM5436X265N]
IC2  INA185A2  [SOTFL50P160X60-6N]
Q14  FDD4685  [FFSD10120A]
Q15  BSS138  [SOT-23-3]
R89  15K OHM 5% 1/2W  [RESC3116X65X45NL15T20]
R90  15K OHM 5% 1/2W  [RESC3116X65X45NL15T20]
R91  22K  [R0805]
R92  330 1%  [R0805]
R93  0.5W 0.02 OHM 1%  [RESC3116X65X45NL15T20]

### Ports
MOTOR+ (out), MOTOR- (out), MOTOR_CTRL (out, harness MOTOR_HN), V+MOTOR (in), V-MOTOR (in)

### Harnesses
MOTOR_HN: PWM, CSENSE

### Nets
+3V3: C68.1 IC2.6(VS)
GND: C68.2 C69.2 D12.2(A) IC2.2(GND) IC2.4(IN-) IC2.5(REF) Q15.2(S) R91.1 R93.1 ; port V-MOTOR
AD_MOTOR: C69.1 R92.1 ; port MOTOR_CTRL.CSENSE
MOT+: D12.1(K) Q14.3(D) ; port MOTOR+  [project net MOTOR+]
MOT-: IC2.3(IN+) R93.2 ; port MOTOR-  [project net MOTOR-]
PWM_MOTOR: Q15.1(G) R91.2 ; port MOTOR_CTRL.PWM
V+MOTOR: Q14.2(S) R89.2 ; port V+MOTOR  [project net VBATT_]
NetIC2_1: IC2.1(OUT) R92.2
NetQ14_1: Q14.1(G) R89.1 R90.2
NetQ15_3: Q15.3(D) R90.1

### Layout directives
net class MOTORPOWER: (no net found under the mark)

### Notes on the sheet
- (near IC2) Vout=Imotor*1
- (near IC2) 50V/V Gain
- Pololu 3227 DC Motor
- General specifications
  Gear ratio:	20.4:1
  No-load speed @ 12V:	370 rpm
  No-load current @ 12V:	200 mA
  Stall current @ 12V:	2100 mA
  Stall torque @ 12V:	42 oz·in
  No-load speed @ 6V:	185 rpm
  Stall current @ 6V:	1050 mA
  Stall torque @ 6V:	21 oz·in
  Motor type:	2.1A stall @ 12V (MP 12V)
  Encoders?:	N
- Title
- Size:
- Date:
- Letter
- Number:
- Time:
- Revision:
- Sheet
- of
- Fluid Power Training
- Institute Inc.
- 2170 S 3040 W
- Salt Lake City, 84119,UT.
- United States.
- File:

### Library data of the parts
C68 C69 = C0805C104K5RACTU: Cap Ceramic 0.1uF 50V X7R 10% SMD 2.0 x 1.2 mm 125 C Paper T/R; Manufacturer: KEMET; Capacitance: 100nF; Voltage: 500V; Supplier 1: Mouser; Supplier Part Number 1: 80-C0805C104K5R; Manufacturer Part Number: C0805C104K5RACTU; RoHS: Yes; Category: Ceramic Capacitors; Stock 1: 4177670; Pricing 1: 1=0.17000, 10=0.10400, 100=0.05600, 500=0.03900, 1000=0.03200, 4000=0.02400 (USD); Mount: Surface Mount,PCB; Case/Package: 0805; Number of Pins: 2; Case Code (Imperial): 0805; Case Code (Metric): 2012; Dielectric Material: Ceramic; Contact Plating: Tin,Matte; Min Operating Temperature: -55°C; Max Operating Temperature: 125°C; Voltage Rating: 50V; Tolerance: 10%; Packaging: Tape and Reel; Dielectric: X7R; Package Quantity: 4000; Voltage Rating (DC): 50V; Termination: SMD/SMT; Length: 2mm; Height: 0.9mm; Width: 1.2mm; Depth: 1.25mm; Thickness: 0.035inch; Lead Pitch: 0.75mm; Radiation Hardening: No; REACH SVHC: No SVHC; ComponentLink1URL: https://datasheet.ciiva.com/14589/70095383-14589048.pdf?src-supplier=Allied+Electronics; ComponentLink1Description: https://datasheet.ciiva.com/14589/70095383-14589048.pdf?src-supplier=Allied+Electronics; ComponentLink2URL: https://datasheet.ciiva.com/28682/1851736-28682232.pdf?src-supplier=Element14; ComponentLink2Description: https://datasheet.ciiva.com/28682/1851736-28682232.pdf?src-supplier=Element14; ComponentLink3URL: https://datasheet.ciiva.com/32431/slceramic-chip-condensers-e-32431755.pdf?src-supplier=Distrelec; ComponentLink3Description: https://datasheet.ciiva.com/32431/slceramic-chip-condensers-e-32431755.pdf?src-supplier=Distrelec; ComponentLink4URL: https://datasheet.ciiva.com/18410/70095383-18410815.pdf?src-supplier=Allied+Electronics; ComponentLink4Description: https://datasheet.ciiva.com/18410/70095383-18410815.pdf?src-supplier=Allied+Electronics
D12 = STPS340UY: DIODE SCHOTTKY 40V 3A SMB; Manufacturer_Name: STMicroelectronics; Peak Reverse Current: 20uA; Peak Non-Repetitive Surge Current: 75A; Element Configuration: Single; Forward Voltage: 840mV; Max Reverse Leakage Current: 10mA; Datasheet Link: https://ms.componentsearchengine.com/Datasheets/2/STPS340UY.pdf; Height: 2.65mm; Manufacturer_Part_Number: STPS340UY; Supplier 1: Mouser; Supplier Part Number 1: 511-STPS340UY; Manufacturer: STMicroelectronics; Manufacturer Part Number: STPS340UY; RoHS: Yes; Category: Rectifier Diodes; Stock 1: 8864; Pricing 1: 1=0.76000, 10=0.62700, 100=0.40400, 1000=0.32400, 2500=0.27300, 10000=0.26300, 25000=0.25300, 50000=0.24900, 100000=0.24300 (USD); Mount: Surface Mount; Case/Package: SMB; Number of Pins: 2; Min Operating Temperature: -40°C; Max Operating Temperature: 150°C; Forward Current: 3A; Max Repetitive Reverse Voltage (Vrrm): 40V; Max Surge Current: 75A; Packaging: Tape and Reel; Package Quantity: 1; Average Rectified Current: 3A; Max Reverse Voltage (DC): 40V; Radiation Hardening: No; Lead Free: Lead Free; ComponentLink1URL: https://datasheet.ciiva.com/25949/cd00270569-25949389.pdf?src-supplier=Avnet+Europe; ComponentLink1Description: https://datasheet.ciiva.com/25949/cd00270569-25949389.pdf?src-supplier=Avnet+Europe; ComponentLink2URL: https://datasheet.ciiva.com/13083/cd00270569-13083318.pdf?src-supplier=Mouser; ComponentLink2Description: https://datasheet.ciiva.com/13083/cd00270569-13083318.pdf?src-supplier=Mouser; ComponentLink3URL: https://datasheet.ciiva.com/6381/cd00270569-6381594.pdf?src-supplier=Digi-Key; ComponentLink3Description: https://datasheet.ciiva.com/6381/cd00270569-6381594.pdf?src-supplier=Digi-Key; ComponentLink4URL: https://datasheet.ciiva.com/6381/cd00270569-6381595.pdf?src-supplier=Digi-Key; ComponentLink4Description: https://datasheet.ciiva.com/6381/cd00270569-6381595.pdf?src-supplier=Digi-Key; ComponentLink5URL: https://datasheet.ciiva.com/6381/cd00270569-6381596.pdf?src-supplier=Digi-Key; ComponentLink5Description: https://datasheet.ciiva.com/6381/cd00270569-6381596.pdf?src-supplier=Digi-Key
IC2 = INA185A2IDRLR: Current Sense Amplifiers A 595-INA185A2IDRLT; Manufacturer: Texas Instruments; Supplier 1: Mouser; Manufacturer Part Number: INA185A2IDRLR; RoHS: No; Stock 1: 5511; Pricing 1: 1=1.68000, 10=1.43000, 100=1.14000, 500=1.00000, 1000=0.82900, 4000=0.74300, 8000=0.71500 (USD); Supplier Part Number 1: 595-INA185A2IDRLR
Q14 = FDD4685: Trans MOSFET P-CH 40V 8.4A 3-Pin(2+Tab) DPAK T/R; Manufacturer: ON Semiconductor / Fairchild; Rise Time: 15ns; Fall Time: 14ns; Turn-Off Delay Time: 34ns; Gate to Source Voltage (Vgs): 20V; Rds On Max: 27mR; Input Capacitance: 2.38nF; Max Power Dissipation: 69W; Turn-On Delay Time: 8ns; Drain to Source Breakdown Voltage: -40V; Number of Elements: 1; Element Configuration: Single; Nominal Vgs: -1.6V; Current Rating: -8.4A; Supplier 1: Mouser; Manufacturer Part Number: FDD4685; RoHS: Yes; Category: Integrated Circuits (ICs); Stock 1: 9242; Pricing 1: 1=1.02000, 10=0.87500, 100=0.67200, 500=0.59400, 1000=0.46900, 2500=0.44700 (USD); Mount: Surface Mount; Case/Package: TO-252; Number of Pins: 3; Weight: 0.26037g; Contact Plating: Tin,Matte; Min Operating Temperature: -55°C; Max Operating Temperature: 150°C; Continuous Drain Current (ID): 8.4A; Package Quantity: 2500; Packaging: Tape and Reel; Drain to Source Voltage (Vdss): 40V; Power Dissipation: 69W; Drain to Source Resistance: 27mR; Threshold Voltage: -1.6V; Voltage Rating (DC): -40V; Dual Supply Voltage: -40V; Termination: SMD/SMT; On-State Resistance: 27MR; Length: 6.73mm; Height: 2.39mm; Width: 6.22mm; Radiation Hardening: No; Lead Free: Lead Free; REACH SVHC: No SVHC; ComponentLink1URL: https://datasheet.ciiva.com/6382/fdd4685-6382336.pdf?src-supplier=Digi-Key; ComponentLink1Description: https://datasheet.ciiva.com/6382/fdd4685-6382336.pdf?src-supplier=Digi-Key; ComponentLink2URL: https://datasheet.ciiva.com/22700/298848-22700881.pdf?src-supplier=Element14; ComponentLink2Description: https://datasheet.ciiva.com/22700/298848-22700881.pdf?src-supplier=Element14; ComponentLink3URL: https://datasheet.ciiva.com/4439/fdd4685-94891-4439978.pdf?src-supplier=Mouser; ComponentLink3Description: https://datasheet.ciiva.com/4439/fdd4685-94891-4439978.pdf?src-supplier=Mouser; ComponentLink4URL: https://datasheet.ciiva.com/16742/fdd4685-16742918.pdf?src-supplier=Future+Electronics; ComponentLink4Description: https://datasheet.ciiva.com/16742/fdd4685-16742918.pdf?src-supplier=Future+Electronics; ComponentLink5URL: https://datasheet.ciiva.com/7967/298848-7967879.pdf?src-supplier=Element14; ComponentLink5Description: https://datasheet.ciiva.com/7967/298848-7967879.pdf?src-supplier=Element14; ComponentLink6URL: https://datasheet.ciiva.com/26144/fdd4685-26144727.pdf?src-supplier=Avnet+Europe; ComponentLink6Description: https://datasheet.ciiva.com/26144/fdd4685-26144727.pdf?src-supplier=Avnet+Europe; ComponentLink7URL: https://datasheet.ciiva.com/22746/1930081-22746458.pdf?src-supplier=Element14; ComponentLink7Description: https://datasheet.ciiva.com/22746/1930081-22746458.pdf?src-supplier=Element14; ComponentLink8URL: https://datasheet.ciiva.com/11175/fdd4685-11175308.pdf?src-supplier=Avnet; ComponentLink8Description: https://datasheet.ciiva.com/11175/fdd4685-11175308.pdf?src-supplier=Avnet; ComponentLink9URL: https://datasheet.ciiva.com/22655/1930081-22655292.pdf?src-supplier=Element14; ComponentLink9Description: https://datasheet.ciiva.com/22655/1930081-22655292.pdf?src-supplier=Element14; Supplier Part Number 1: 512-FDD4685
Q15 = BSS138: MOSFET N-CH 50V 220MA SOT-23; Manufacturer: ON Semiconductor / Fairchild; Element Configuration: Single; Rds On Max: 3.5R; Input Capacitance: 27pF; Max Power Dissipation: 360mW; Rise Time: 9ns; Turn-Off Delay Time: 20ns; Gate to Source Voltage (Vgs): 20V; Turn-On Delay Time: 2.5ns; Number of Elements: 1; Threshold Voltage: 1.3V; On-State Resistance: 6R; Supplier 1: Mouser; Manufacturer Part Number: BSS138; RoHS: Yes; Category: MOSFETs; Stock 1: 736044; Pricing 1: 1=0.26000, 10=0.17800, 100=0.07400, 1000=0.05000, 3000=0.03900, 9000=0.03300, 24000=0.03100, 45000=0.02900 (USD); Mount: Surface Mount; Case/Package: SOT-23; Number of Pins: 3; Weight: 0.03g; Contact Plating: Tin,Matte; Min Operating Temperature: -55°C; Max Operating Temperature: 150°C; Packaging: Tape and Reel; Continuous Drain Current (ID): 220mA; Drain to Source Voltage (Vdss): 50V; Drain to Source Breakdown Voltage: 50V; Fall Time: 9ns; Drain to Source Resistance: 3.5R; Package Quantity: 1; Power Dissipation: 360mW; Voltage Rating (DC): 50V; Current Rating: 220mA; Nominal Vgs: 1.3V; Dual Supply Voltage: 50V; Termination: SMD/SMT; Length: 2.92mm; Height: 0.93mm; Width: 1.3mm; Radiation Hardening: No; Lead Free: Lead Free; REACH SVHC: No SVHC; ComponentLink1URL: https://datasheet.ciiva.com/931/bss138-931776.pdf?src-supplier=Digi-Key; ComponentLink1Description: https://datasheet.ciiva.com/931/bss138-931776.pdf?src-supplier=Digi-Key; ComponentLink2URL: https://datasheet.ciiva.com/1190/193736-1190130.pdf?src-supplier=Element14; ComponentLink2Description: https://datasheet.ciiva.com/1190/193736-1190130.pdf?src-supplier=Element14; ComponentLink3URL: https://datasheet.ciiva.com/27050/784896-27050043.pdf?src-supplier=Jameco; ComponentLink3Description: https://datasheet.ciiva.com/27050/784896-27050043.pdf?src-supplier=Jameco; ComponentLink4URL: https://datasheet.ciiva.com/1190/193736-1190131.pdf?src-supplier=Element14; ComponentLink4Description: https://datasheet.ciiva.com/1190/193736-1190131.pdf?src-supplier=Element14; ComponentLink5URL: https://datasheet.ciiva.com/1254/193736-1254983.pdf?src-supplier=Newark; ComponentLink5Description: https://datasheet.ciiva.com/1254/193736-1254983.pdf?src-supplier=Newark; ComponentLink6URL: https://datasheet.ciiva.com/16834/bss138-16834843.pdf?src-supplier=Future+Electronics; ComponentLink6Description: https://datasheet.ciiva.com/16834/bss138-16834843.pdf?src-supplier=Future+Electronics; ComponentLink7URL: https://datasheet.ciiva.com/26229/bss138-26229007.pdf?src-supplier=Avnet+Europe; ComponentLink7Description: https://datasheet.ciiva.com/26229/bss138-26229007.pdf?src-supplier=Avnet+Europe; ComponentLink8URL: https://datasheet.ciiva.com/3304/bss138-3304424.pdf?src-supplier=Avnet; ComponentLink8Description: https://datasheet.ciiva.com/3304/bss138-3304424.pdf?src-supplier=Avnet; ComponentLink9URL: https://datasheet.ciiva.com/22655/193736-22655240.pdf?src-supplier=Element14; ComponentLink9Description: https://datasheet.ciiva.com/22655/193736-22655240.pdf?src-supplier=Element14; Supplier Part Number 1: 512-BSS138
R89 R90 = ESR18EZPJ153: RES SMD 15K OHM 5% 1/2W 1206; Manufacturer: Rohm; Resistance: 6.2kR; Max Power Dissipation: 500mW; Temperature Coefficient: 200ppm/°C; Supplier 1: Mouser; Manufacturer Part Number: ESR18EZPJ153; RoHS: Yes; Category: Chip SMD Resistors; Stock 1: 9337; Pricing 1: 1=0.16000, 10=0.14200, 100=0.05000, 1000=0.03400, 5000=0.02600, 10000=0.02200 (USD); Case/Package: 1206; Case Code (Imperial): 1206; Case Code (Metric): 3216; Min Operating Temperature: -55°C; Max Operating Temperature: 155°C; Composition: Thick Film; Features: Automotive AEC-Q200; Packaging: Tape and Reel; Tolerance: 5%; Number of Terminations: 2; ComponentLink1URL: https://www.rohm.com/datasheet/ESR01MZPF/esr-e?src-supplier=Digi-Key; ComponentLink1Description: https://www.rohm.com/datasheet/ESR01MZPF/esr-e?src-supplier=Digi-Key; Supplier Part Number 1: 755-ESR18EZPJ153
R91 = ERJ6ENF2202V: PANASONIC - ERJ6ENF2202V - SMD Chip Resistor, 0805 [2012 Metric], 22 kohm, ERJ6EN Series, 150 V, Thick Film, 125 mW; Resistance: 22kR; Tolerance: 1%; Temperature Coefficient: 100ppm/°C; Power Rating: 125mW; Voltage Rating: 150V; Supplier 1: Mouser; Supplier Part Number 1: 667-ERJ-6ENF2202V; Manufacturer: Panasonic; Manufacturer Part Number: ERJ6ENF2202V; RoHS: Yes; Category: Chip SMD Resistors; Stock 1: 57430; Pricing 1: 1=0.10000, 10=0.08300, 100=0.03200, 1000=0.01800, 5000=0.01800, 10000=0.01800 (USD); Mount: Surface Mount; Case/Package: 0805; Number of Pins: 2; Case Code (Imperial): 0805; Case Code (Metric): 2012; Contact Plating: Tin; Min Operating Temperature: -55°C; Max Operating Temperature: 155°C; Packaging: Tape and Reel; Composition: Thick Film; Number of Terminations: 2; Max Power Dissipation: 125mW; Termination: SMD/SMT; Package Quantity: 1; Voltage Rating (DC): 150V; Features: Automotive AEC-Q200; Military Standard: Not; Length: 2mm; Height: 0.6mm; Width: 1.2mm; Depth: 1.25mm; Radiation Hardening: No; Lead Free: Lead Free; REACH SVHC: No SVHC; ComponentLink1URL: https://datasheet.ciiva.com/11821/0900766b80f80784-11821559.pdf?src-supplier=RSComponents; ComponentLink1Description: https://datasheet.ciiva.com/11821/0900766b80f80784-11821559.pdf?src-supplier=RSComponents; ComponentLink2URL: https://datasheet.ciiva.com/24070/aoa0000ce2-24070245.pdf?src-supplier=Mouser; ComponentLink2Description: https://datasheet.ciiva.com/24070/aoa0000ce2-24070245.pdf?src-supplier=Mouser; ComponentLink3URL: https://datasheet.ciiva.com/30139/aoa0000ce2-30139797.pdf?src-supplier=Onlinecomponents.com; ComponentLink3Description: https://datasheet.ciiva.com/30139/aoa0000ce2-30139797.pdf?src-supplier=Onlinecomponents.com; ComponentLink4URL: https://datasheet.ciiva.com/7802/426256-7802439.pdf?src-supplier=Element14; ComponentLink4Description: https://datasheet.ciiva.com/7802/426256-7802439.pdf?src-supplier=Element14; ComponentLink5URL: https://datasheet.ciiva.com/22687/1678782-22687079.pdf?src-supplier=Element14; ComponentLink5Description: https://datasheet.ciiva.com/22687/1678782-22687079.pdf?src-supplier=Element14; ComponentLink6URL: https://datasheet.ciiva.com/16787/70260748-16787961.pdf?src-supplier=Allied+Electronics; ComponentLink6Description: https://datasheet.ciiva.com/16787/70260748-16787961.pdf?src-supplier=Allied+Electronics; ComponentLink7URL: https://datasheet.ciiva.com/17210/aoa0000ce2-17210956.pdf?src-supplier=Avnet+Europe; ComponentLink7Description: https://datasheet.ciiva.com/17210/aoa0000ce2-17210956.pdf?src-supplier=Avnet+Europe; ComponentLink8URL: https://datasheet.ciiva.com/22668/1678782-22668332.pdf?src-supplier=Element14; ComponentLink8Description: https://datasheet.ciiva.com/22668/1678782-22668332.pdf?src-supplier=Element14; ComponentLink9URL: https://datasheet.ciiva.com/6138/426256-6138190.pdf?src-supplier=Farnell; ComponentLink9Description: https://datasheet.ciiva.com/6138/426256-6138190.pdf?src-supplier=Farnell; ComponentLink10URL: https://datasheet.ciiva.com/46419/1678782-46419998.pdf?src-supplier=Element14; ComponentLink10Description: https://datasheet.ciiva.com/46419/1678782-46419998.pdf?src-supplier=Element14
R92 = ERJ-6ENF3300V: RES SMD 330 OHM 1% 1/8W 0805; Manufacturer: Panasonic; Resistance: 330R; Power Rating: 125mW; Temperature Coefficient: 100ppm/°C; Voltage Rating: 150V; Supplier 1: Mouser; Supplier Part Number 1: 667-ERJ-6ENF3300V; Manufacturer Part Number: ERJ-6ENF3300V; RoHS: Yes; Category: Chip SMD Resistors; Stock 1: 121287; Pricing 1: 1=0.10000, 10=0.08900, 100=0.03500, 500=0.03500, 1000=0.01900, 5000=0.01700 (USD); Mount: Surface Mount; Case/Package: 0805; Number of Pins: 2; Case Code (Imperial): 0805; Case Code (Metric): 2012; Contact Plating: Tin; Min Operating Temperature: -55°C; Max Operating Temperature: 155°C; Packaging: Tape and Reel; Tolerance: 1%; Composition: Thick Film; Termination: SMD/SMT; Number of Terminations: 2; Max Power Dissipation: 125mW; Package Quantity: 1; Military Standard: Not; Features: Automotive AEC-Q200; Length: 2mm; Height: 0.6mm; Width: 1.2mm; Depth: 1.25mm; Radiation Hardening: No; REACH SVHC: No SVHC; ComponentLink1URL: https://datasheet.ciiva.com/11821/0900766b80f80784-11821635.pdf?src-supplier=RSComponents; ComponentLink1Description: https://datasheet.ciiva.com/11821/0900766b80f80784-11821635.pdf?src-supplier=RSComponents; ComponentLink2URL: https://datasheet.ciiva.com/30131/aoa0000ce2-30131349.pdf?src-supplier=Onlinecomponents.com; ComponentLink2Description: https://datasheet.ciiva.com/30131/aoa0000ce2-30131349.pdf?src-supplier=Onlinecomponents.com; ComponentLink3URL: https://datasheet.ciiva.com/24025/aoa0000ce2-24025991.pdf?src-supplier=Mouser; ComponentLink3Description: https://datasheet.ciiva.com/24025/aoa0000ce2-24025991.pdf?src-supplier=Mouser; ComponentLink4URL: https://datasheet.ciiva.com/17206/aoa0000ce2-17206152.pdf?src-supplier=Avnet+Europe; ComponentLink4Description: https://datasheet.ciiva.com/17206/aoa0000ce2-17206152.pdf?src-supplier=Avnet+Europe; ComponentLink5URL: https://datasheet.ciiva.com/46436/1678782-46436633.pdf?src-supplier=Element14; ComponentLink5Description: https://datasheet.ciiva.com/46436/1678782-46436633.pdf?src-supplier=Element14; ComponentLink6URL: https://datasheet.ciiva.com/46436/1678782-46436634.pdf?src-supplier=Element14; ComponentLink6Description: https://datasheet.ciiva.com/46436/1678782-46436634.pdf?src-supplier=Element14; ComponentLink7URL: https://datasheet.ciiva.com/16760/70260748-16760668.pdf?src-supplier=Allied+Electronics; ComponentLink7Description: https://datasheet.ciiva.com/16760/70260748-16760668.pdf?src-supplier=Allied+Electronics; ComponentLink8URL: https://datasheet.ciiva.com/16780/70260748-16780764.pdf?src-supplier=Allied+Electronics; ComponentLink8Description: https://datasheet.ciiva.com/16780/70260748-16780764.pdf?src-supplier=Allied+Electronics; ComponentLink9URL: https://datasheet.ciiva.com/22684/1678782-22684798.pdf?src-supplier=Element14; ComponentLink9Description: https://datasheet.ciiva.com/22684/1678782-22684798.pdf?src-supplier=Element14; ComponentLink10URL: https://datasheet.ciiva.com/28590/1678782-28590783.pdf?src-supplier=Element14; ComponentLink10Description: https://datasheet.ciiva.com/28590/1678782-28590783.pdf?src-supplier=Element14
R93 = L4T12FR020FER: Current Sense Resistors - SMD 0.5W 0.02 OHM 1%; Manufacturer: Ohmite; Manufacturer Part Number: L4T12FR020FER; RoHS: No; Stock 1: 4995; Pricing 1: 1=0.170000, 10=0.166000, 25=0.146000, 50=0.133000, 100=0.115000, 250=0.100000, 500=0.083000, 1000=0.068000, 5000=0.064000 (USD); Supplier 1: Mouser; Supplier Part Number 1: 284-L4T12FR020FER